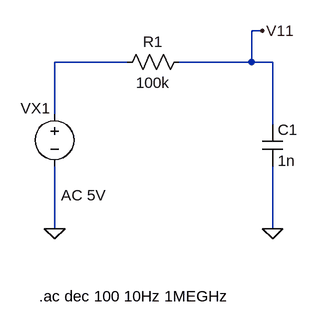
[diagram p0: schematic Cópia de Ex_04_AnaliseAC.asc]
Cópia de Ex_04_AnaliseAC.asc, the LTspice schematic file:
Version 4
SHEET 1 960 680
WIRE 144 16 128 16
WIRE -64 64 -176 64
WIRE 128 64 128 16
WIRE 128 64 16 64
WIRE 160 64 128 64
WIRE -176 144 -176 64
WIRE 160 160 160 64
WIRE -176 320 -176 224
WIRE 160 320 160 224
FLAG -176 320 0
FLAG 160 320 0
FLAG 144 16 V11
SYMBOL res 32 48 R90
WINDOW 0 0 56 VBottom 0
WINDOW 3 32 56 VTop 0
SYMATTR InstName R1
SYMATTR Value 100k
SYMBOL cap 144 160 R0
SYMATTR InstName C1
SYMATTR Value 1n
SYMBOL voltage -176 128 R0
WINDOW 123 10 141 Left 0
WINDOW 39 0 0 Left 0
WINDOW 0 -52 7 Left 0
WINDOW 3 10 113 Left 0
SYMATTR Value2 AC 5V
SYMATTR InstName VX1
SYMATTR Value ""
TEXT -200 424 Left 0 !.ac dec 100 10Hz 1MEGHz

The netlist it stands for:
* Cópia de Ex_04_AnaliseAC.asc
R1 V11 N001 100k
C1 V11 0 1n
VX1 N001 0 AC 5V
.ac dec 100 10Hz 1MEGHz
.backanno
.end